# Altium schematic sheet Nguyenli.SchDoc
size A2
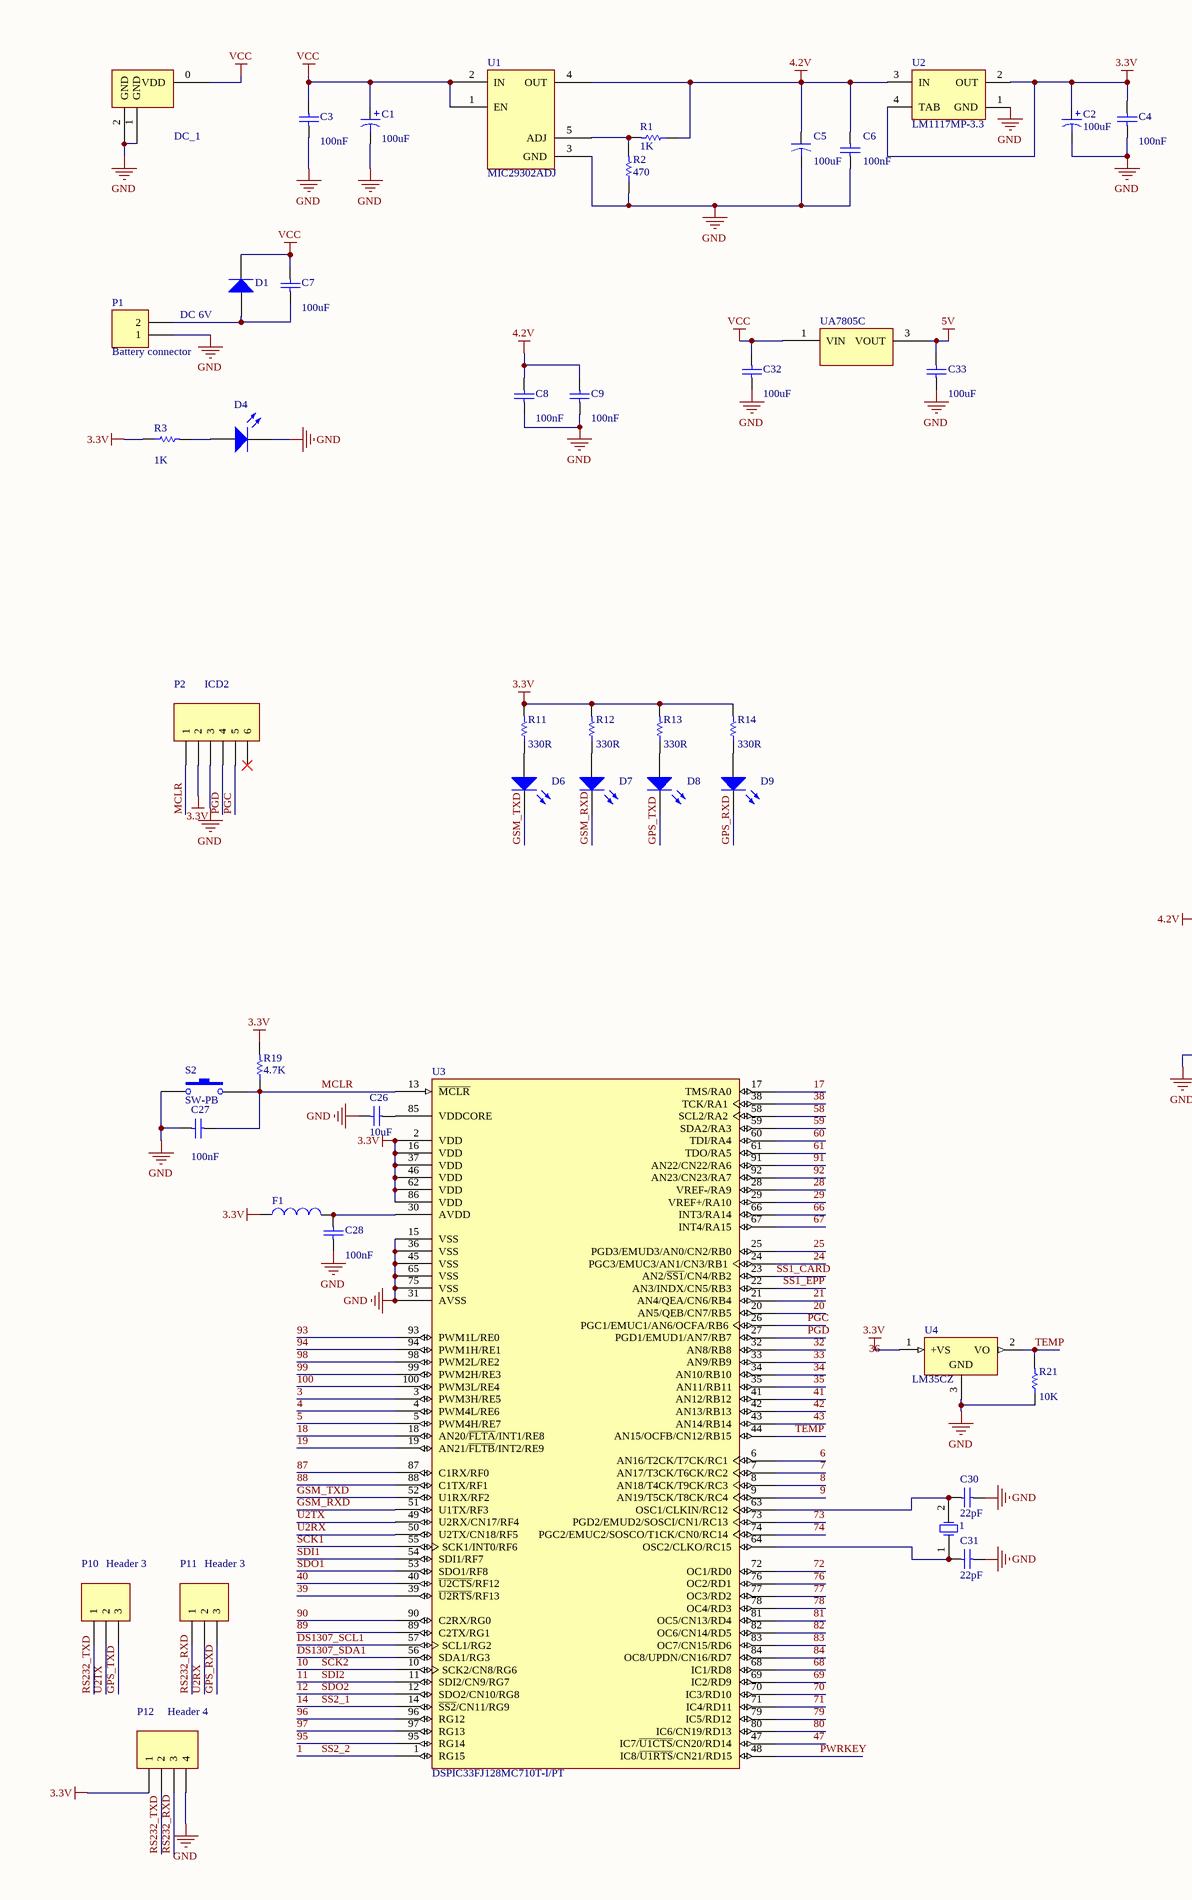
[diagram p0: Nguyenli.SchDoc, left]
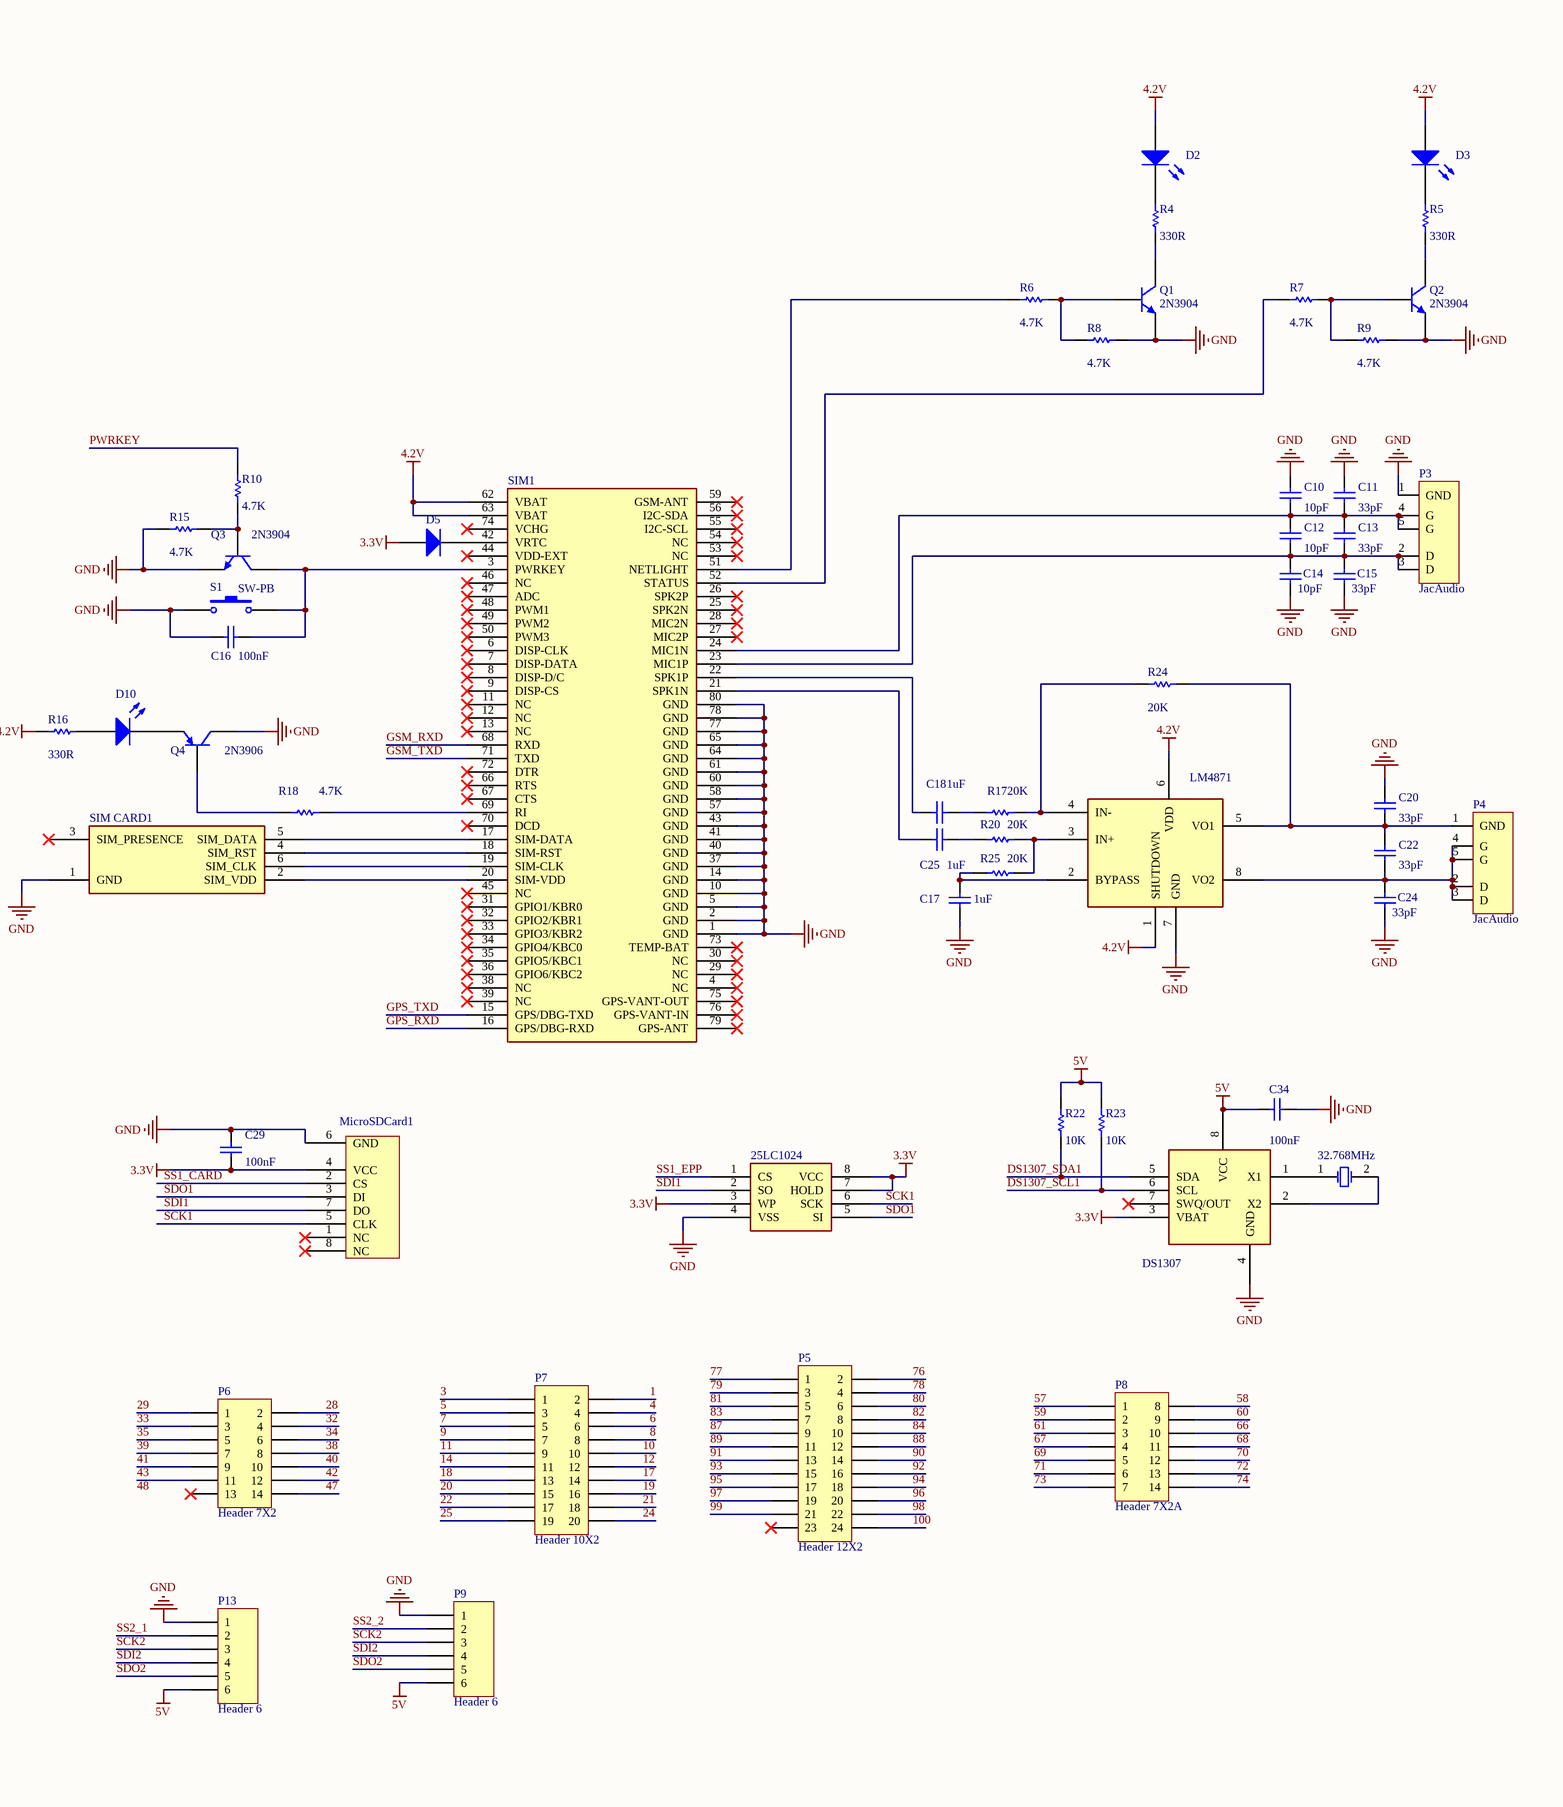
[diagram p1: Nguyenli.SchDoc, right]

## Parts
1  8MHz  [CRYSTAL]  (value not drawn)
25LC1024  25LC1024  [SOIC208-8_M]  (value not drawn)
32.768MHz  XTAL  [R38]  (value not drawn)
C1  value 100uF  [SM/C_1812]  (hidden comment: Cap Pol3)
C2  value 100uF  [SM/C_1812]  (hidden comment: Cap Pol3)
C3  value 100nF  [SM/C_0805]  (hidden comment: Cap)
C4  value 100nF  [SM/C_0805]  (hidden comment: Cap)
C5  value 100uF  [SM/C_1812]  (hidden comment: Cap2)
C6  value 100nF  [SM/C_0805]  (hidden comment: Cap Semi)
C7  value 100uF  [SM/C_0805]  (hidden comment: Cap)
C8  value 100nF  [SM/C_0603]  (hidden comment: Cap)
C9  value 100nF  [SM/C_0603]  (hidden comment: Cap)
C10  value 10pF  [SM/C_0603]  (hidden comment: Cap Semi)
C11  value 33pF  [SM/C_0603]  (hidden comment: Cap Semi)
C12  value 10pF  [SM/C_0603]  (hidden comment: Cap Semi)
C13  value 33pF  [SM/C_0603]  (hidden comment: Cap Semi)
C14  value 10pF  [SM/C_0603]  (hidden comment: Cap Semi)
C15  value 33pF  [SM/C_0603]  (hidden comment: Cap Semi)
C16  value 100nF  [SM/C_0603]  (hidden comment: Cap)
C17  value 1uF  [SM/C_0805]  (hidden comment: Cap)
C18  value 1uF  [SM/C_0603]  (hidden comment: Cap)
C20  value 33pF  [SM/C_0603]  (hidden comment: Cap Semi)
C22  value 33pF  [SM/C_0603]  (hidden comment: Cap Semi)
C24  value 33pF  [SM/C_0603]  (hidden comment: Cap Semi)
C25  value 1uF  [SM/C_0603]  (hidden comment: Cap)
C26  value 10uF  [SM/C_1210]  (hidden comment: Cap Semi)
C27  value 100nF  [SM/C_0603]  (hidden comment: Cap)
C28  value 100nF  [SM/C_0603]  (hidden comment: Cap Semi)
C29  value 100nF  [SM/C_0603]  (hidden comment: Cap)
C30  value 22pF  [SM/C_0603]  (hidden comment: Cap Semi)
C31  value 22pF  [SM/C_0603]  (hidden comment: Cap Semi)
C32  value 100uF  [SM/C_1812]  (hidden comment: Cap)
C33  value 100uF  [SM/C_1812]  (hidden comment: Cap)
C34  value 100nF  [SM/C_0805]  (hidden comment: Cap)
D1  M7  [SM/DO214AA_21]  (value not drawn)
D2  LED0  [SM/C_0805]  (value not drawn)
D3  LED0  [SM/C_0805]  (value not drawn)
D4  LED0  [SM/C_0805]  (value not drawn)
D5  Diode  [SM/DO214AA_21]  (value not drawn)
D6  LED0  [SM/C_0805]  (value not drawn)
D7  LED0  [SM/C_0805]  (value not drawn)
D8  LED0  [SM/C_0805]  (value not drawn)
D9  LED0  [SM/C_0805]  (value not drawn)
D10  LED0  [SM/C_0805]  (value not drawn)
DC_1  Jac_DC  [Jac_DC]  (value not drawn)
DS1307  DS1307  (value not drawn)
F1  Inductor  [SM/C_1210]  (value not drawn)
LM4871  LM4871  [D008_M]  (value not drawn)
MicroSDCard1  MicroSDCard  [MICROSD CARD]  (value not drawn)
P1  Battery connector  [HEADERCN02B]
P2  ICD2  [HDR1X6]
P3  JacAudio  [JACK_A_3.5MM_REV5_2]
P4  JacAudio  [JACK_A_3.5MM_REV5_2]
P5  Header 12X2  [HDR2X12]
P6  Header 7X2  [HDR2X7]
P7  Header 10X2  [HDR2X10]
P8  Header 7X2A  [HDR2X7_CEN]
P9  Header 6  [HDR1X6]
P10  Header 3  [HDR1X3]
P11  Header 3  [HDR1X3]
P12  Header 4  [HDR1X4]
P13  Header 6  [HDR1X6]
Q1  2N3904  [2N3904]
Q2  2N3904  [2N3904]
Q3  2N3904  [2N3904]
Q4  2N3906  [2N3904]
R1  value 1K  [SM/C_0805]  (hidden comment: Res Semi)
R2  value 470  [SM/C_0805]  (hidden comment: Res Semi)
R3  value 1K  [SM/C_0603]  (hidden comment: Res1)
R4  value 330R  [SM/C_0603]  (hidden comment: Res1)
R5  value 330R  [SM/C_0603]  (hidden comment: Res1)
R6  value 4.7K  [SM/C_0603]  (hidden comment: Res1)
R7  value 4.7K  [SM/C_0603]  (hidden comment: Res1)
R8  value 4.7K  [SM/C_0603]  (hidden comment: Res1)
R9  value 4.7K  [SM/C_0603]  (hidden comment: Res1)
R10  value 4.7K  [SM/C_0603]  (hidden comment: Res1)
R11  value 330R  [SM/C_0603]  (hidden comment: Res1)
R12  value 330R  [SM/C_0603]  (hidden comment: Res1)
R13  value 330R  [SM/C_0603]  (hidden comment: Res1)
R14  value 330R  [SM/C_0603]  (hidden comment: Res1)
R15  value 4.7K  [SM/C_0603]  (hidden comment: Res1)
R16  value 330R  [SM/C_0603]  (hidden comment: Res1)
R17  value 20K  [SM/C_0603]  (hidden comment: Res1)
R18  value 4.7K  [SM/C_0603]  (hidden comment: Res1)
R19  value 4.7K  [SM/C_0805]  (hidden comment: Res Semi)
R20  value 20K  [SM/C_0603]  (hidden comment: Res1)
R21  value 10K  [SM/C_0603]  (hidden comment: Res1)
R22  value 10K  [SM/C_0603]  (hidden comment: Res1)
R23  value 10K  [SM/C_0603]  (hidden comment: Res1)
R24  value 20K  [SM/C_0603]  (hidden comment: Res1)
R25  value 20K  [SM/C_0603]  (hidden comment: Res1)
S1  SW-PB  [KEYSMALL2]
S2  SW-PB  [KEYSMALL2]
SIM1  SIM908  [SIM908]  (value not drawn)
SIM_CARD1  SIM CARD  [SIMCARD6pin]  (value not drawn)
U1  MIC29302ADJ  [MIC29302]
U2  LM1117MP-3.3  [SM/SOT223_1234]
U3  DSPIC33FJ128MC710T-I/PT  [TQFP-PF100_N]
U4  LM35CZ  [Z03A]
UA7805C  UA7805C  [UA7805C]  (value not drawn)

## Nets
3.3V: 25LC1024.3(WP) 25LC1024.7(HOLD) 25LC1024.8(VCC) C2.1 C4.2 C29.1 D5.1(A) DS1307.3(VBAT) F1.1 MicroSDCard1.4(VCC) P2.2 P12.1 R3.1 R11.2 R12.2 R13.2 R14.2 R19.2 U2.2(OUT) U2.4(TAB) U3.2(VDD) U3.16(VDD) U3.37(VDD) U3.46(VDD) U3.62(VDD) U3.86(VDD) U4.1(+VS)
4.2V: C5.1 C6.2 C8.2 C9.2 D2.1(A) D3.1(A) LM4871.1(SHUTDOWN) LM4871.6(VDD) R1.1 R16.1 SIM1.62(VBAT) SIM1.63(VBAT) U1.4(OUT) U2.3(IN)
5V: C33.2 C34.1 DS1307.8(VCC) P9.6 P13.6 R22.2 R23.2 UA7805C.3(VOUT)
GND: 25LC1024.4(VSS) C1.2 C2.2 C3.1 C4.1 C5.2 C6.1 C8.1 C9.1 C10.2 C11.2 C14.1 C15.1 C16.1 C17.1 C20.2 C24.1 C26.2 C27.1 C28.1 C29.2 C30.1 C31.1 C32.1 C33.1 C34.2 D4.2(K) DC_1.1(GND) DC_1.2(GND) DS1307.4(GND) LM4871.7(GND) MicroSDCard1.6(GND) P1.1 P2.3 P3.1(GND) P9.1 P12.4 P13.1 Q1.1(E) Q2.1(E) Q3.1(E) Q4.3(C) R2.1 R8.2 R9.2 R15.1 R21.1 S1.1 S2.1 SIM1.1(GND) SIM1.2(GND) SIM1.5(GND) SIM1.10(GND) SIM1.14(GND) SIM1.37(GND) SIM1.40(GND) SIM1.41(GND) SIM1.43(GND) SIM1.57(GND) SIM1.58(GND) SIM1.60(GND) SIM1.61(GND) SIM1.64(GND) SIM1.65(GND) SIM1.77(GND) SIM1.78(GND) SIM1.80(GND) SIM_CARD1.1(GND) U1.3(GND) U2.1(GND) U3.15(VSS) U3.31(AVSS) U3.36(VSS) U3.45(VSS) U3.65(VSS) U3.75(VSS) U4.3(GND) UA7805C.2(GND)
VCC: C1.1 C3.2 C7.2 C32.2 D1.2(K) DC_1.0(VDD) U1.1(EN) U1.2(IN) UA7805C.1(VIN)
1: P7.2 P9.2 U3.1(RG15)  [also labelled SS2_2]
3: P7.1 U3.3(PWM3H/RE5)
4: P7.4 U3.4(PWM4L/RE6)
5: P7.3 U3.5(PWM4H/RE7)
6: P7.6 U3.6(AN16/T2CK/T7CK/RC1)
7: P7.5 U3.7(AN17/T3CK/T6CK/RC2)
8: P7.8 U3.8(AN18/T4CK/T9CK/RC3)
9: P7.7 U3.9(AN19/T5CK/T8CK/RC4)
10: P7.10 P9.3 P13.3 U3.10(SCK2/CN8/RG6)  [also labelled SCK2]
11: P7.9 P9.4 P13.4 U3.11(SDI2/CN9/RG7)  [also labelled SDI2]
12: P7.12 P9.5 P13.5 U3.12(SDO2/CN10/RG8)  [also labelled SDO2]
14: P7.11 P13.2 U3.14(~{SS2}/CN11/RG9)  [also labelled SS2_1]
17: P7.14 U3.17(TMS/RA0)
18: P7.13 U3.18(AN20/~{FLTA}/INT1/RE8)
19: P7.16 U3.19(AN21/~{FLTB}/INT2/RE9)
20: P7.15 U3.20(AN5/QEB/CN7/RB5)
21: P7.18 U3.21(AN4/QEA/CN6/RB4)
22: P7.17
24: P7.20 U3.24(PGC3/EMUC3/AN1/CN3/RB1)
25: P7.19 U3.25(PGD3/EMUD3/AN0/CN2/RB0)
28: P6.2 U3.28(VREF-/RA9)
29: P6.1 U3.29(VREF+/RA10)
32: P6.4 U3.32(AN8/RB8)
33: P6.3 U3.33(AN9/RB9)
34: P6.6 U3.34(AN10/RB10)
35: P6.5 U3.35(AN11/RB11)
38: P6.8 U3.38(TCK/RA1)
39: P6.7 U3.39(~{U2RTS}/RF13)
40: P6.10 U3.40(~{U2CTS}/RF12)
41: P6.9 U3.41(AN12/RB12)
42: P6.12 U3.42(AN13/RB13)
43: P6.11 U3.43(AN14/RB14)
47: P6.14 U3.47(IC7/~{U1CTS}/CN20/RD14)
57: P8.1
58: P8.8 U3.58(SCL2/RA2)
59: P8.2 U3.59(SDA2/RA3)
60: P8.9 U3.60(TDI/RA4)
61: P8.3 U3.61(TDO/RA5)
66: P8.10 U3.66(INT3/RA14)
67: P8.4 U3.67(INT4/RA15)
68: P8.11 U3.68(IC1/RD8)
69: P8.5 U3.69(IC2/RD9)
70: P8.12 U3.70(IC3/RD10)
71: P8.6 U3.71(IC4/RD11)
72: P8.13 U3.72(OC1/RD0)
73: P8.7 U3.73(PGD2/EMUD2/SOSCI/CN1/RC13)
74: P8.14 U3.74(PGC2/EMUC2/SOSCO/T1CK/CN0/RC14)
76: P5.2 U3.76(OC2/RD1)
77: P5.1 U3.77(OC3/RD2)
78: P5.4 U3.78(OC4/RD3)
79: P5.3 U3.79(IC5/RD12)
80: P5.6 U3.80(IC6/CN19/RD13)
81: P5.5 U3.81(OC5/CN13/RD4)
82: P5.8 U3.82(OC6/CN14/RD5)
83: P5.7 U3.83(OC7/CN15/RD6)
84: P5.10 U3.84(OC8/UPDN/CN16/RD7)
87: P5.9 U3.87(C1RX/RF0)
88: P5.12 U3.88(C1TX/RF1)
89: P5.11 U3.89(C2TX/RG1)
90: P5.14 U3.90(C2RX/RG0)
91: P5.13 U3.91(AN22/CN22/RA6)
92: P5.16 U3.92(AN23/CN23/RA7)
93: P5.15 U3.93(PWM1L/RE0)
94: P5.18 U3.94(PWM1H/RE1)
95: P5.17 U3.95(RG14)
96: P5.20 U3.96(RG12)
97: P5.19 U3.97(RG13)
98: P5.22 U3.98(PWM2L/RE2)
99: P5.21 U3.99(PWM2H/RE3)
100: P5.24 U3.100(PWM3L/RE4)
DS1307_SCL1: DS1307.6(SCL) R23.1 U3.57(SCL1/RG2)
DS1307_SDA1: DS1307.5(SDA) R22.1 U3.56(SDA1/RG3)
GPS_RXD: D9.2(K) P11.3 SIM1.16(GPS/DBG-RXD)
GPS_TXD: D8.2(K) P10.3 SIM1.15(GPS/DBG-TXD)
GSM_RXD: D7.2(K) SIM1.68(RXD) U3.51(U1TX/RF3)
GSM_TXD: D6.2(K) SIM1.71(TXD) U3.52(U1RX/RF2)
MCLR: C27.2 P2.1 R19.1 S2.2 U3.13(~{MCLR})
PGC: P2.5 U3.26(PGC1/EMUC1/AN6/OCFA/RB6)
PGD: P2.4 U3.27(PGD1/EMUD1/AN7/RB7)
PWRKEY: R10.2 U3.48(IC8/~{U1RTS}/CN21/RD15)
RS232_RXD: P11.1 P12.3
RS232_TXD: P10.1 P12.2
SCK1: 25LC1024.6(SCK) MicroSDCard1.5(CLK) U3.55(SCK1/INT0/RF6)
SDI1: 25LC1024.2(SO) MicroSDCard1.7(DO) U3.54(SDI1/RF7)
SDO1: 25LC1024.5(SI) MicroSDCard1.3(DI) U3.53(SDO1/RF8)
SS1_CARD: MicroSDCard1.2(CS) U3.23(AN2/~{SS1}/CN4/RB2)
SS1_EPP: 25LC1024.1(CS) U3.22(AN3/INDX/CN5/RB3)
TEMP: R21.2 U3.44(AN15/OCFB/CN12/RB15) U4.2(VO)
U2RX: P11.2 U3.50(U2TX/CN18/RF5)
U2TX: P10.2 U3.49(U2RX/CN17/RF4)
Net1_1: 1.1(OSC1) C31.2 U3.64(OSC2/CLKO/RC15)
Net1_2: 1.2(OSC2) C30.2 U3.63(OSC1/CLKIN/RC12)
Net32.768MHz_1: 32.768MHz.1(OSC1) DS1307.1(X1)
Net32.768MHz_2: 32.768MHz.2(OSC2) DS1307.2(X2)
NetC7_1: C7.1 D1.1(A) P1.2
NetC10_1: C10.1 C11.1 C12.2 C13.2 P3.4(G) P3.5(G) SIM1.24(MIC1N)
NetC12_1: C12.1 C13.1 C14.2 C15.2 P3.2(D) P3.3(D) SIM1.23(MIC1P)
NetC16_2: C16.2 Q3.3(C) S1.2 SIM1.3(PWRKEY)
NetC17_2: C17.2 LM4871.2(BYPASS) R25.1
NetC18_1: C18.1 SIM1.22(SPK1P)
NetC18_2: C18.2 R17.1
NetC20_1: C20.1 C22.2 LM4871.5(VO1) P4.1(GND) R24.2
NetC22_1: C22.1 C24.2 LM4871.8(VO2) P4.2(D) P4.3(D) P4.4(G) P4.5(G)
NetC25_1: C25.1 SIM1.21(SPK1N)
NetC25_2: C25.2 R20.1
NetC26_1: C26.1 U3.85(VDDCORE)
NetC28_2: C28.2 F1.2 U3.30(AVDD)
NetD2_2: D2.2(K) R4.2
NetD3_2: D3.2(K) R5.2
NetD4_1: D4.1(A) R3.2
NetD5_2: D5.2(K) SIM1.42(VRTC)
NetD6_1: D6.1(A) R11.1
NetD7_1: D7.1(A) R12.1
NetD8_1: D8.1(A) R13.1
NetD9_1: D9.1(A) R14.1
NetD10_1: D10.1(A) R16.2
NetD10_2: D10.2(K) Q4.1(E)
NetLM4871_3: LM4871.3(IN+) R20.2 R25.2
NetLM4871_4: LM4871.4(IN-) R17.2 R24.1
NetQ1_2: Q1.2(B) R6.2 R8.1
NetQ1_3: Q1.3(C) R4.1
NetQ2_2: Q2.2(B) R7.2 R9.1
NetQ2_3: Q2.3(C) R5.1
NetQ3_2: Q3.2(B) R10.1 R15.2
NetQ4_2: Q4.2(B) R18.1
NetR1_2: R1.2 R2.2 U1.5(ADJ)
NetR6_1: R6.1 SIM1.51(NETLIGHT)
NetR7_1: R7.1 SIM1.52(STATUS)
NetR18_2: R18.2 SIM1.69(RI)
NetSIM1_17: SIM1.17(SIM-DATA) SIM_CARD1.5(SIM_DATA)
NetSIM1_18: SIM1.18(SIM-RST) SIM_CARD1.4(SIM_RST)
NetSIM1_19: SIM1.19(SIM-CLK) SIM_CARD1.6(SIM_CLK)
NetSIM1_20: SIM1.20(SIM-VDD) SIM_CARD1.2(SIM_VDD)

Not connected (* = marked no-connect by the designer): DS1307 7(SWQ/OUT)*; MicroSDCard1 1(NC)* 8(NC)*; P2 6*; P5 23*; P6 13*; SIM1 4(NC)* 6(DISP-CLK)* 7(DISP-DATA)* 8(DISP-D/C)* 9(DISP-CS)* 11(NC)* 12(NC)* 13(NC)* 25(SPK2N)* 26(SPK2P)* 27(MIC2P)* 28(MIC2N)* 29(NC)* 30(NC)* 31(GPIO1/KBR0)* 32(GPIO2/KBR1)* 33(GPIO3/KBR2)* 34(GPIO4/KBC0)* 35(GPIO5/KBC1)* 36(GPIO6/KBC2)* 38(NC)* 39(NC)* 44(VDD-EXT)* 45(NC)* 46(NC)* 47(ADC)* 48(PWM1)* 49(PWM2)* 50(PWM3)* 53(NC)* 54(NC)* 55(I2C-SCL)* 56(I2C-SDA)* 59(GSM-ANT)* 66(RTS)* 67(CTS)* 70(DCD)* 72(DTR)* 73(TEMP-BAT)* 74(VCHG)* 75(GPS-VANT-OUT)* 76(GPS-VANT-IN)* 79(GPS-ANT)*; SIM_CARD1 3(SIM_PRESENCE)*

## Notes on the sheet
- DC 6V
- Labels drawn without touching a wire or pin: 36, 48

## Library data of the parts
1 32.768MHz = XTAL: Crystal Oscillator; Published: 8-Jun-2000; LatestRevisionDate: 17-Jul-2002; LatestRevisionNote: Re-released for DXP Platform.; PackageReference: R38; Publisher: Altium Limited
C1 C2 = Cap Pol3: Polarized Capacitor (Surface Mount); Published: 8-Jun-2000; LatestRevisionDate: 29-May-2009; LatestRevisionNote: IPC-7351 Footprint Added.; PackageReference: C0805; Publisher: Altium Limited; PackageDescription: Chip Capacitor
C3 C4 C7-C9 C16-C18 C25 C27 C29 C32-C34 = Cap: Capacitor; Published: 8-Jun-2000; LatestRevisionDate: 17-Jul-2002; LatestRevisionNote: Re-released for DXP Platform.; PackageReference: RAD-0.3; Publisher: Altium Limited
C5 = Cap2: Capacitor; Published: 23-Sep-2002; PackageReference: CAPR5-4X5; Publisher: Altium Limited
C6 C10-C15 C20 C22 C24 C26 C28 C30 C31 = Cap Semi: Capacitor (Semiconductor SIM Model); Published: 8-Jun-2000; LatestRevisionDate: 29-May-2009; LatestRevisionNote: IPC-7351 Footprint Added.; PackageReference: C1206; Publisher: Altium Limited; PackageDescription: Chip Capacitor
D1 = Diode 1N4007: 1 Amp General Purpose Rectifier; Published: 8-Jun-2000; LatestRevisionDate: 17-Jul-2002; LatestRevisionNote: Re-released for DXP Platform.; DatasheetVersion: 1998; PackageVersion: Aug-1999; PackageReference: DO-41; Publisher: Altium Limited; Code_JEDEC: DO-204-AL; ComponentLink1Description: Manufacturer Link; ComponentLink1URL: http://www.fairchildsemi.com/; ComponentLink2Description: Datasheet; ComponentLink2URL: http://www.fairchildsemi.com/ds/1N%2F1N4001.pdf
D2-D4 D6-D10 = LED0: Typical INFRARED GaAs LED; Published: 8-Jun-2000; LatestRevisionDate: 08-Jul-2005; LatestRevisionNote: Mech Layer 1 removed.; PackageReference: LED-0; Publisher: Altium Limited
D5 = Diode: Default Diode; Published: 8-Jun-2000; LatestRevisionDate: 17-Jul-2002; LatestRevisionNote: Re-released for DXP Platform.; PackageDocument: Sep-1996; PackageReference: SMC; Publisher: Altium Limited; Code_JEDEC: DO-214-AB
F1 = Inductor: Code_IEC: 1005; Value: 10mH; Published: 8-Jun-2000; LatestRevisionDate: 29-May-2009; LatestRevisionNote: IPC-7351 Footprint Added.; PackageReference: 0402-A; Publisher: Altium Limited; PackageDescription: Chip Inductor; Code_JEITA: 0402
P1 = Header 2: Header, 2-Pin; LatestRevisionDate: 17-Jul-2002; LatestRevisionNote: Re-released for DXP Platform.; Publisher: Altium Limited
P2 P9 P13 = Header 6: Header, 6-Pin; LatestRevisionDate: 17-Jul-2002; LatestRevisionNote: Re-released for DXP Platform.; Publisher: Altium Limited
P5 = Header 12X2: Header, 12-Pin, Dual row; LatestRevisionDate: 17-Jul-2002; LatestRevisionNote: Re-released for DXP Platform.; Publisher: Altium Limited
P6 = Header 7X2: Header, 7-Pin, Dual row; LatestRevisionDate: 17-Jul-2002; LatestRevisionNote: Re-released for DXP Platform.; Publisher: Altium Limited
P7 = Header 10X2: Header, 10-Pin, Dual row; LatestRevisionDate: 17-Jul-2002; LatestRevisionNote: Re-released for DXP Platform.; Publisher: Altium Limited
P8 = Header 7X2A: Header, 7-Pin, Dual row; LatestRevisionDate: 17-Jul-2002; LatestRevisionNote: Re-released for DXP Platform.; Publisher: Altium Limited
P10 P11 = Header 3: Header, 3-Pin; LatestRevisionDate: 17-Jul-2002; LatestRevisionNote: Re-released for DXP Platform.; Publisher: Altium Limited
P12 = Header 4: Header, 4-Pin; LatestRevisionDate: 17-Jul-2002; LatestRevisionNote: Re-released for DXP Platform.; Publisher: Altium Limited
Q1-Q3 = 2N3904: NPN General Purpose Amplifier; Published: 8-Jun-2000; LatestRevisionDate: 15-Jan-2003; LatestRevisionNote: PCB Footprint 'BCY-W3/D4.7' replaced; DatasheetDocument: 1997; PackageDocument: Sep-1998; PackageReference: TO-92A; Publisher: Altium Limited; Code_JEDEC: TO-92A; ComponentLink1Description: Manufacturer Link; ComponentLink1URL: http://www.fairchildsemi.com/; ComponentLink2Description: Datasheet; ComponentLink2URL: http://www.fairchildsemi.com/ds/2N%2F2N3904.pdf
Q4 = 2N3906: PNP General Purpose Amplifier; Published: 8-Jun-2000; LatestRevisionDate: 15-Jan-2003; LatestRevisionNote: PCB Footprint 'BCY-W3/D4.7' replaced; DatasheetDocument: 1997; PackageDocument: Sep-1998; PackageReference: TO-92A; Publisher: Altium Limited; Code_JEDEC: TO-92A; ComponentLink1Description: Manufacturer Link; ComponentLink1URL: http://www.fairchildsemi.com/; ComponentLink2Description: Datasheet; ComponentLink2URL: http://www.fairchildsemi.com/ds/2N%2F2N3906.pdf
R1 R2 R19 = Res Semi: Semiconductor Resistor; Published: 8-Jun-2000; LatestRevisionDate: 17-Jul-2002; LatestRevisionNote: Re-released for DXP Platform.; PackageReference: AXIAL-0.5; Publisher: Altium Limited
R3-R18 R20-R25 = Res1: Resistor; Published: 8-Jun-2000; LatestRevisionDate: 17-Jul-2002; LatestRevisionNote: Re-released for DXP Platform.; PackageReference: AXIAL-0.3; Publisher: Altium Limited
S1 S2 = SW-PB: Switch; Published: 24-Mar-1999; LatestRevisionDate: 17-Jul-2002; LatestRevisionNote: Re-released for DXP Platform.; PackageReference: SPST-2; Publisher: Altium Limited
U2 = LM1117MP-3.3: 800mA Low-Dropout Linear Regulator; Manufacturer: National Semiconductor; CompType: LDO IC; PackageTopMarking: XYTT*N05A; Published: 27-Nov-2008; DatasheetVersion: Apr-2006; PackageVersion: revB, Apr-2003; PackageReference: MP04A; Publisher: Altium Limited; PackageDescription: Molded SOT-223, 6.50 x 3.56 x 1.6mm Body, 4 Lead, 2.3mm Pitch; PartNumber: LM1117MP-3.3; RoHS: O; PinCount: 4; DigiKeyPartNumber: LM1117MP-3.3CT-ND; Code_JEDEC: TO-261-AA; Code_IPC: SOT223-4; ComponentLink1Description: LM1117 Datasheet; ComponentLink1URL: http://www.national.com/ds/LM/LM1117.pdf; ComponentLink2Description: LM1117 Web Page; ComponentLink2URL: http://www.national.com/pf/LM/LM1117.html; ComponentLink3Description: MP04A Package Page; ComponentLink3URL: http://www.national.com/packaging/folders/mp04a.html
U3 = DSPIC33FJ128MC710T-I/PT: High-Performance 16-bit Digital Signal Controller, 128 KB Flash, 16 KB RAM, 100-Pin TQFP, Industrial Temperature, Tape and Reel; Published: 29-Jan-2009; DatasheetVersion: revA, Jun-2007; PackageVersion: revAW, Oct-2008; PackageReference: TQFP-PT100; Publisher: Altium Limited; PackageDescription: 100-Lead Plastic Thin Quad Flatpack (PT) - 12x12x1mm Body, 2.00mm [TQFP]; ComponentLink1Description: Manufacturer Link; ComponentLink1URL: http://www.microchip.com; ComponentLink2Description: Datasheet; ComponentLink2URL: http://ww1.microchip.com/downloads/en/DeviceDoc/70287A.pdf; ComponentLink3Description: Packaging Specification; ComponentLink3URL: http://ww1.microchip.com/downloads/en/PackagingSpec/00049AW.pdf
U4 = LM35CZ: Precision Centigrade Temperature Sensor; Manufacturer: National Semiconductor; CompType: Temp Sensor IC; PackageTopMarking: NSXYTT*LM35*CZ; PowerWise: N; Published: 4-Dec-2008; LatestRevisionDate: 15-Jul-2009; LatestRevisionNote: Sch pins 1 & 3 reversed.; DatasheetVersion: Nov-2000; PackageVersion: revG, Sep-2000; PackageReference: Z03A; Publisher: Altium Limited; PackageDescription: TO-92, Molded, 3 Lead; PartNumber: LM35CZ; RoHS: O; PinCount: 3; DigiKeyPartNumber: LM35CZ-ND; Code_JEDEC: TO-226-AA; ComponentLink1Description: LM35 Datasheet; ComponentLink1URL: http://www.national.com/ds/LM/LM35.pdf; ComponentLink2Description: LM35 Web Page; ComponentLink2URL: http://www.national.com/pf/LM/LM35.html; ComponentLink3Description: Z03A Package Page; ComponentLink3URL: http://www.national.com/packaging/folders/z03a.html